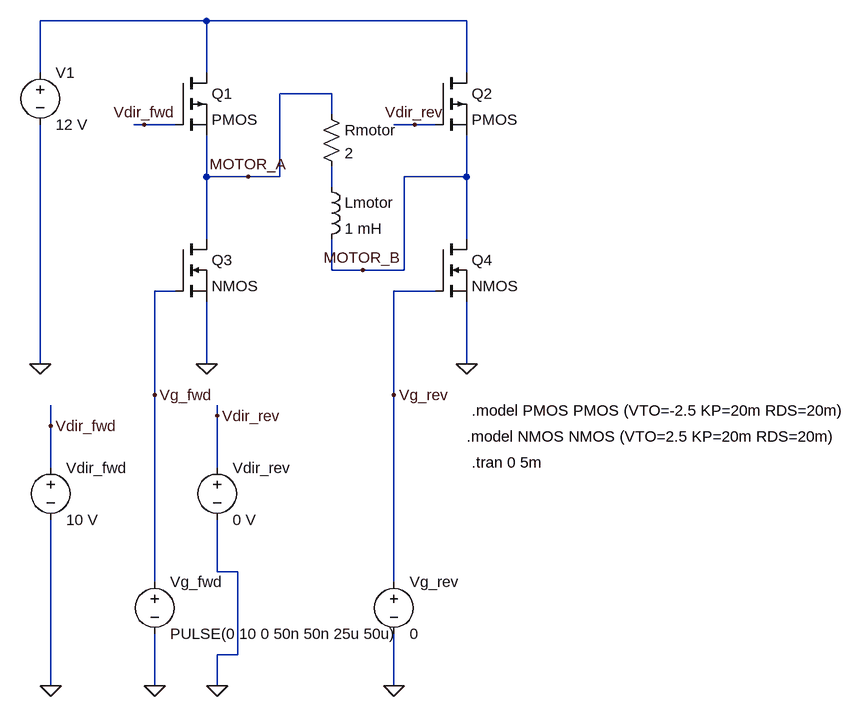
[diagram p0: schematic h_bridge_pwm.asc]
h_bridge_pwm.asc, the LTspice schematic file:
Version 4
SHEET 1 1864 680
WIRE 672 -832 416 -832
WIRE 1072 -832 672 -832
WIRE 416 -752 416 -832
WIRE 672 -752 672 -832
WIRE 1072 -752 1072 -832
WIRE 864 -720 784 -720
WIRE 864 -688 864 -720
WIRE 576 -672 560 -672
WIRE 624 -672 576 -672
WIRE 992 -672 960 -672
WIRE 1024 -672 992 -672
WIRE 672 -592 672 -656
WIRE 736 -592 672 -592
WIRE 784 -592 784 -720
WIRE 784 -592 736 -592
WIRE 1072 -592 1072 -656
WIRE 1072 -592 976 -592
WIRE 864 -576 864 -608
WIRE 672 -496 672 -592
WIRE 1072 -496 1072 -592
WIRE 864 -448 864 -496
WIRE 912 -448 864 -448
WIRE 976 -448 976 -592
WIRE 976 -448 912 -448
WIRE 624 -416 592 -416
WIRE 1024 -416 960 -416
WIRE 416 -304 416 -672
WIRE 672 -304 672 -400
WIRE 1072 -304 1072 -400
WIRE 592 -256 592 -416
WIRE 960 -256 960 -416
WIRE 688 -224 688 -240
WIRE 432 -208 432 -240
WIRE 432 -144 432 -208
WIRE 688 -144 688 -224
WIRE 688 16 688 -64
WIRE 720 16 688 16
WIRE 592 32 592 -256
WIRE 960 32 960 -256
WIRE 720 144 720 16
WIRE 720 144 688 144
WIRE 432 192 432 -64
WIRE 592 192 592 112
WIRE 688 192 688 144
WIRE 960 192 960 112
FLAG 1072 -304 0
FLAG 672 -304 0
FLAG 416 -304 0
FLAG 432 -208 Vdir_fwd
FLAG 576 -672 Vdir_fwd
FLAG 992 -672 Vdir_rev
FLAG 688 -224 Vdir_rev
FLAG 432 192 0
FLAG 592 192 0
FLAG 688 192 0
FLAG 960 192 0
FLAG 592 -256 Vg_fwd
FLAG 960 -256 Vg_rev
FLAG 736 -592 MOTOR_A
FLAG 912 -448 MOTOR_B
SYMBOL voltage 416 -768 R0
SYMATTR InstName V1
SYMATTR Value 12 V
SYMBOL nmos 624 -496 R0
SYMATTR InstName Q3
SYMBOL nmos 1024 -496 R0
SYMATTR InstName Q4
SYMBOL res 848 -704 R0
SYMATTR InstName Rmotor
SYMATTR Value 2
SYMBOL ind 848 -592 R0
SYMATTR InstName Lmotor
SYMATTR Value 1 mH
SYMBOL voltage 592 16 R0
SYMATTR InstName Vg_fwd
SYMATTR Value PULSE(0 10 0 50n 50n 25u 50u)
SYMBOL voltage 960 16 R0
SYMATTR InstName Vg_rev
SYMATTR Value 0
SYMBOL voltage 432 -160 R0
SYMATTR InstName Vdir_fwd
SYMATTR Value 10 V
SYMBOL voltage 688 -160 R0
SYMATTR InstName Vdir_rev
SYMATTR Value 0 V
SYMBOL pmos 624 -752 R0
SYMATTR InstName Q1
SYMBOL pmos 1024 -752 R0
SYMATTR InstName Q2
TEXT 1072 -192 Left 2 !.model NMOS NMOS (VTO=2.5 KP=20m RDS=20m)
TEXT 1080 -152 Left 2 !.tran 0 5m
TEXT 1080 -232 Left 2 !.model PMOS PMOS (VTO=-2.5 KP=20m RDS=20m)

The netlist it stands for:
* h_bridge_pwm.asc
V1 N001 0 12 V
M§Q3 MOTOR_A Vg_fwd 0 0 NMOS
M§Q4 MOTOR_B Vg_rev 0 0 NMOS
Rmotor MOTOR_A N002 2
Lmotor N002 MOTOR_B 1 mH
Vg_fwd Vg_fwd 0 PULSE(0 10 0 50n 50n 25u 50u)
Vg_rev Vg_rev 0 0
Vdir_fwd Vdir_fwd 0 10 V
Vdir_rev Vdir_rev 0 0 V
M§Q1 N001 Vdir_fwd MOTOR_A MOTOR_A PMOS
M§Q2 N001 Vdir_rev MOTOR_B MOTOR_B PMOS
.model NMOS NMOS
.model PMOS PMOS
.lib standard.mos
.model NMOS NMOS (VTO=2.5 KP=20m RDS=20m)
.tran 0 5m
.model PMOS PMOS (VTO=-2.5 KP=20m RDS=20m)
.backanno
.end